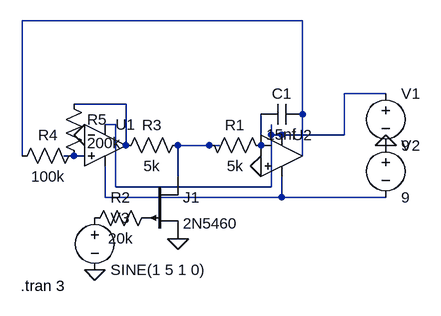
[diagram p0: schematic triangleVCO.asc]
triangleVCO.asc, the LTspice schematic file:
Version 4
SHEET 1 880 680
WIRE 448 -48 16 -48
WIRE 576 64 512 64
WIRE 176 80 96 80
WIRE 448 96 448 -48
WIRE 160 112 144 112
WIRE 400 128 400 112
WIRE 416 128 400 128
WIRE 512 128 512 64
WIRE 512 128 416 128
WIRE 176 144 176 80
WIRE 304 144 256 144
WIRE 320 144 304 144
WIRE 384 144 384 96
WIRE 16 160 16 -48
WIRE 96 160 80 160
WIRE 112 160 96 160
WIRE 448 160 448 96
WIRE 256 192 256 144
WIRE 160 208 160 112
WIRE 400 208 400 128
WIRE 400 208 160 208
WIRE 144 224 144 176
WIRE 416 224 416 192
WIRE 416 224 144 224
WIRE 576 224 416 224
FLAG 256 288 0
FLAG 384 176 0
FLAG 576 144 0
FLAG 128 336 0
FLAG 112 128 0
SYMBOL Opamps\\UniversalOpamp2 416 160 R0
SYMATTR InstName U2
SYMBOL pjf 208 192 R0
SYMATTR InstName J1
SYMATTR Value 2N5460
SYMBOL cap 448 80 R90
WINDOW 0 0 32 VBottom 2
WINDOW 3 32 32 VTop 2
SYMATTR InstName C1
SYMATTR Value 15nf
SYMBOL res 288 128 M90
WINDOW 0 0 56 VBottom 2
WINDOW 3 32 56 VTop 2
SYMATTR InstName R1
SYMATTR Value 5k
SYMBOL res 224 240 R90
WINDOW 0 0 56 VBottom 2
WINDOW 3 32 56 VTop 2
SYMATTR InstName R2
SYMATTR Value 20k
SYMBOL res 272 128 R90
WINDOW 0 0 56 VBottom 2
WINDOW 3 32 56 VTop 2
SYMATTR InstName R3
SYMATTR Value 5k
SYMBOL voltage 576 48 R0
WINDOW 123 0 0 Left 0
WINDOW 39 0 0 Left 0
SYMATTR InstName V1
SYMATTR Value 9
SYMBOL voltage 576 128 R0
WINDOW 123 0 0 Left 0
WINDOW 39 0 0 Left 0
SYMATTR InstName V2
SYMATTR Value 9
SYMBOL voltage 128 240 R0
WINDOW 123 0 0 Left 0
WINDOW 39 0 0 Left 0
SYMATTR InstName V3
SYMATTR Value SINE(1 5 1 0)
SYMBOL Opamps\\UniversalOpamp2 144 144 R0
SYMATTR InstName U1
SYMBOL res 112 144 R90
WINDOW 0 0 56 VBottom 2
WINDOW 3 32 56 VTop 2
SYMATTR InstName R4
SYMATTR Value 100k
SYMBOL res 80 64 R0
SYMATTR InstName R5
SYMATTR Value 200k
TEXT 14 360 Left 2 !.tran 3

The netlist it stands for:
* triangleVCO.asc
XU2 0 N005 N002 N007 N001 level.2 Avol=1Meg GBW=10Meg Slew=10Meg ilimit=25m rail=0 Vos=0 phimargin=45 en=0 enk=0 in=0 ink=0 Rin=500Meg  ; pins IN+ IN- V+ V- OUT
J1 N004 P001 0 2N5460
C1 N001 N005 15nf
R1 N004 N005 5k
R2 P001 P002 20k
R3 N004 N003 5k
V1 N002 0 9
V2 0 N007 9
V3 P002 0 SINE(1 5 1 0)
XU1 N006 0 N002 N007 N003 level.2 Avol=1Meg GBW=10Meg Slew=10Meg ilimit=25m rail=0 Vos=0 phimargin=45 en=0 enk=0 in=0 ink=0 Rin=500Meg  ; pins IN+ IN- V+ V- OUT
R4 N006 N001 100k
R5 N003 N006 200k
.model NJF NJF
.model PJF PJF
.lib standard.jft
.tran 3
.lib UniversalOpamps2.sub
.backanno
.end